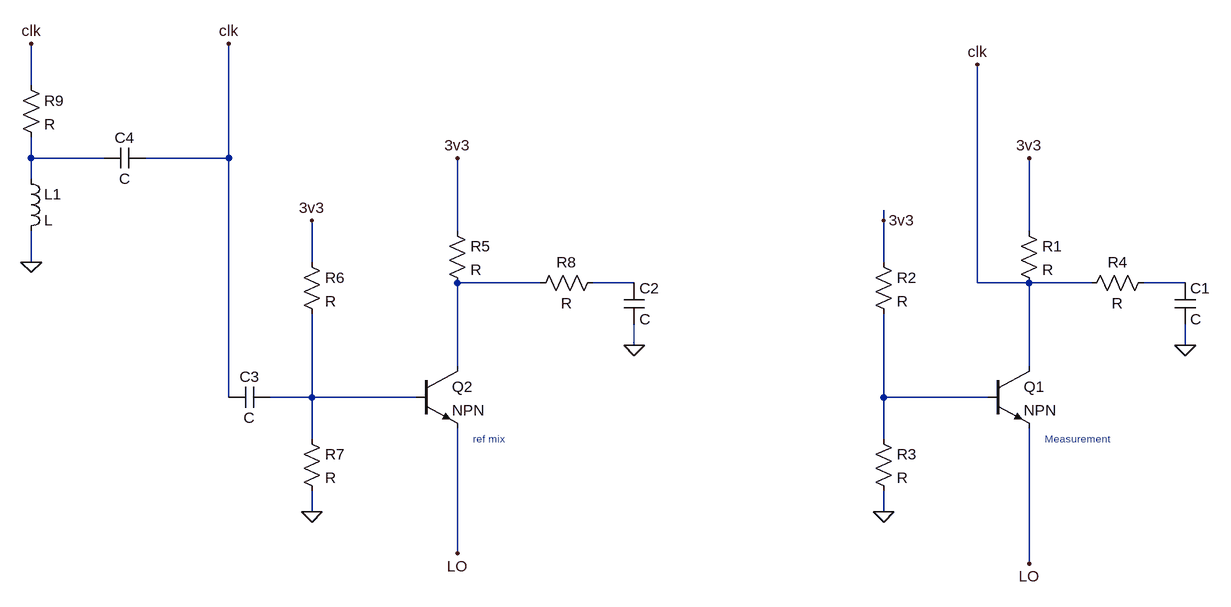
[diagram p0: schematic bjt_mixer.asc]
bjt_mixer.asc, the LTspice schematic file:
Version 4
SHEET 1 880 680
WIRE -1264 -320 -1264 -384
WIRE -1264 -208 -1264 -240
WIRE -1152 -208 -1264 -208
WIRE -960 -208 -960 -384
WIRE -960 -208 -1088 -208
WIRE -1264 -176 -1264 -208
WIRE 48 -112 48 -128
WIRE -608 -96 -608 -208
WIRE 272 -96 272 -208
WIRE -1264 -48 -1264 -96
WIRE -832 -48 -832 -112
WIRE 48 -48 48 -112
WIRE -480 -16 -608 -16
WIRE -336 -16 -400 -16
WIRE 192 -16 192 -352
WIRE 272 -16 192 -16
WIRE 368 -16 272 -16
WIRE 512 -16 448 -16
WIRE -336 80 -336 48
WIRE 512 80 512 48
WIRE -608 112 -608 -16
WIRE 272 112 272 -16
WIRE -960 160 -960 -208
WIRE -832 160 -832 32
WIRE -832 160 -896 160
WIRE -672 160 -832 160
WIRE 48 160 48 32
WIRE 208 160 48 160
WIRE -832 224 -832 160
WIRE 48 224 48 160
WIRE -832 336 -832 304
WIRE 48 336 48 304
WIRE -608 400 -608 208
WIRE 272 416 272 208
FLAG 48 336 0
FLAG 48 -112 3v3
FLAG 272 -208 3v3
FLAG 272 416 LO
FLAG -832 336 0
FLAG -832 -112 3v3
FLAG -608 -208 3v3
FLAG -608 400 LO
FLAG -1264 -384 clk
FLAG -960 -384 clk
FLAG 512 80 0
FLAG -336 80 0
FLAG -1264 -48 0
FLAG 192 -352 clk
SYMBOL npn 208 112 R0
SYMATTR InstName Q1
SYMBOL res 256 -112 R0
SYMATTR InstName R1
SYMBOL res 32 -64 R0
SYMATTR InstName R2
SYMBOL res 32 208 R0
SYMATTR InstName R3
SYMBOL res 464 -32 R90
WINDOW 0 0 56 VBottom 2
WINDOW 3 32 56 VTop 2
SYMATTR InstName R4
SYMBOL cap 496 -16 R0
SYMATTR InstName C1
SYMBOL npn -672 112 R0
SYMATTR InstName Q2
SYMBOL res -624 -112 R0
SYMATTR InstName R5
SYMBOL res -848 -64 R0
SYMATTR InstName R6
SYMBOL res -848 208 R0
SYMATTR InstName R7
SYMBOL res -384 -32 R90
WINDOW 0 0 56 VBottom 2
WINDOW 3 32 56 VTop 2
SYMATTR InstName R8
SYMBOL cap -352 -16 R0
SYMATTR InstName C2
SYMBOL cap -896 144 R90
WINDOW 0 0 32 VBottom 2
WINDOW 3 32 32 VTop 2
SYMATTR InstName C3
SYMBOL res -1280 -336 R0
SYMATTR InstName R9
SYMBOL ind -1280 -192 R0
SYMATTR InstName L1
SYMBOL cap -1088 -224 R90
WINDOW 0 0 32 VBottom 2
WINDOW 3 32 32 VTop 2
SYMATTR InstName C4
TEXT 296 224 Left 1 ;Measurement
TEXT -584 224 Left 1 ;ref mix

The netlist it stands for:
* bjt_mixer.asc
Q1 clk N006 LO 0 NPN
R1 3v3 clk R
R2 3v3 N006 R
R3 N006 0 R
R4 N004 clk R
C1 N004 0 C
Q2 N002 N005 LO 0 NPN
R5 3v3 N002 R
R6 3v3 N005 R
R7 N005 0 R
R8 N003 N002 R
C2 N003 0 C
C3 N005 clk C
R9 clk N001 R
L1 N001 0 L
C4 clk N001 C
.model NPN NPN
.model PNP PNP
.lib standard.bjt
* Measurement
* ref mix
.backanno
.end